# Altium schematic sheet RK3566_USB_GPIO.SchDoc
size A3; SheetNumber: 18; SheetTotal: 20
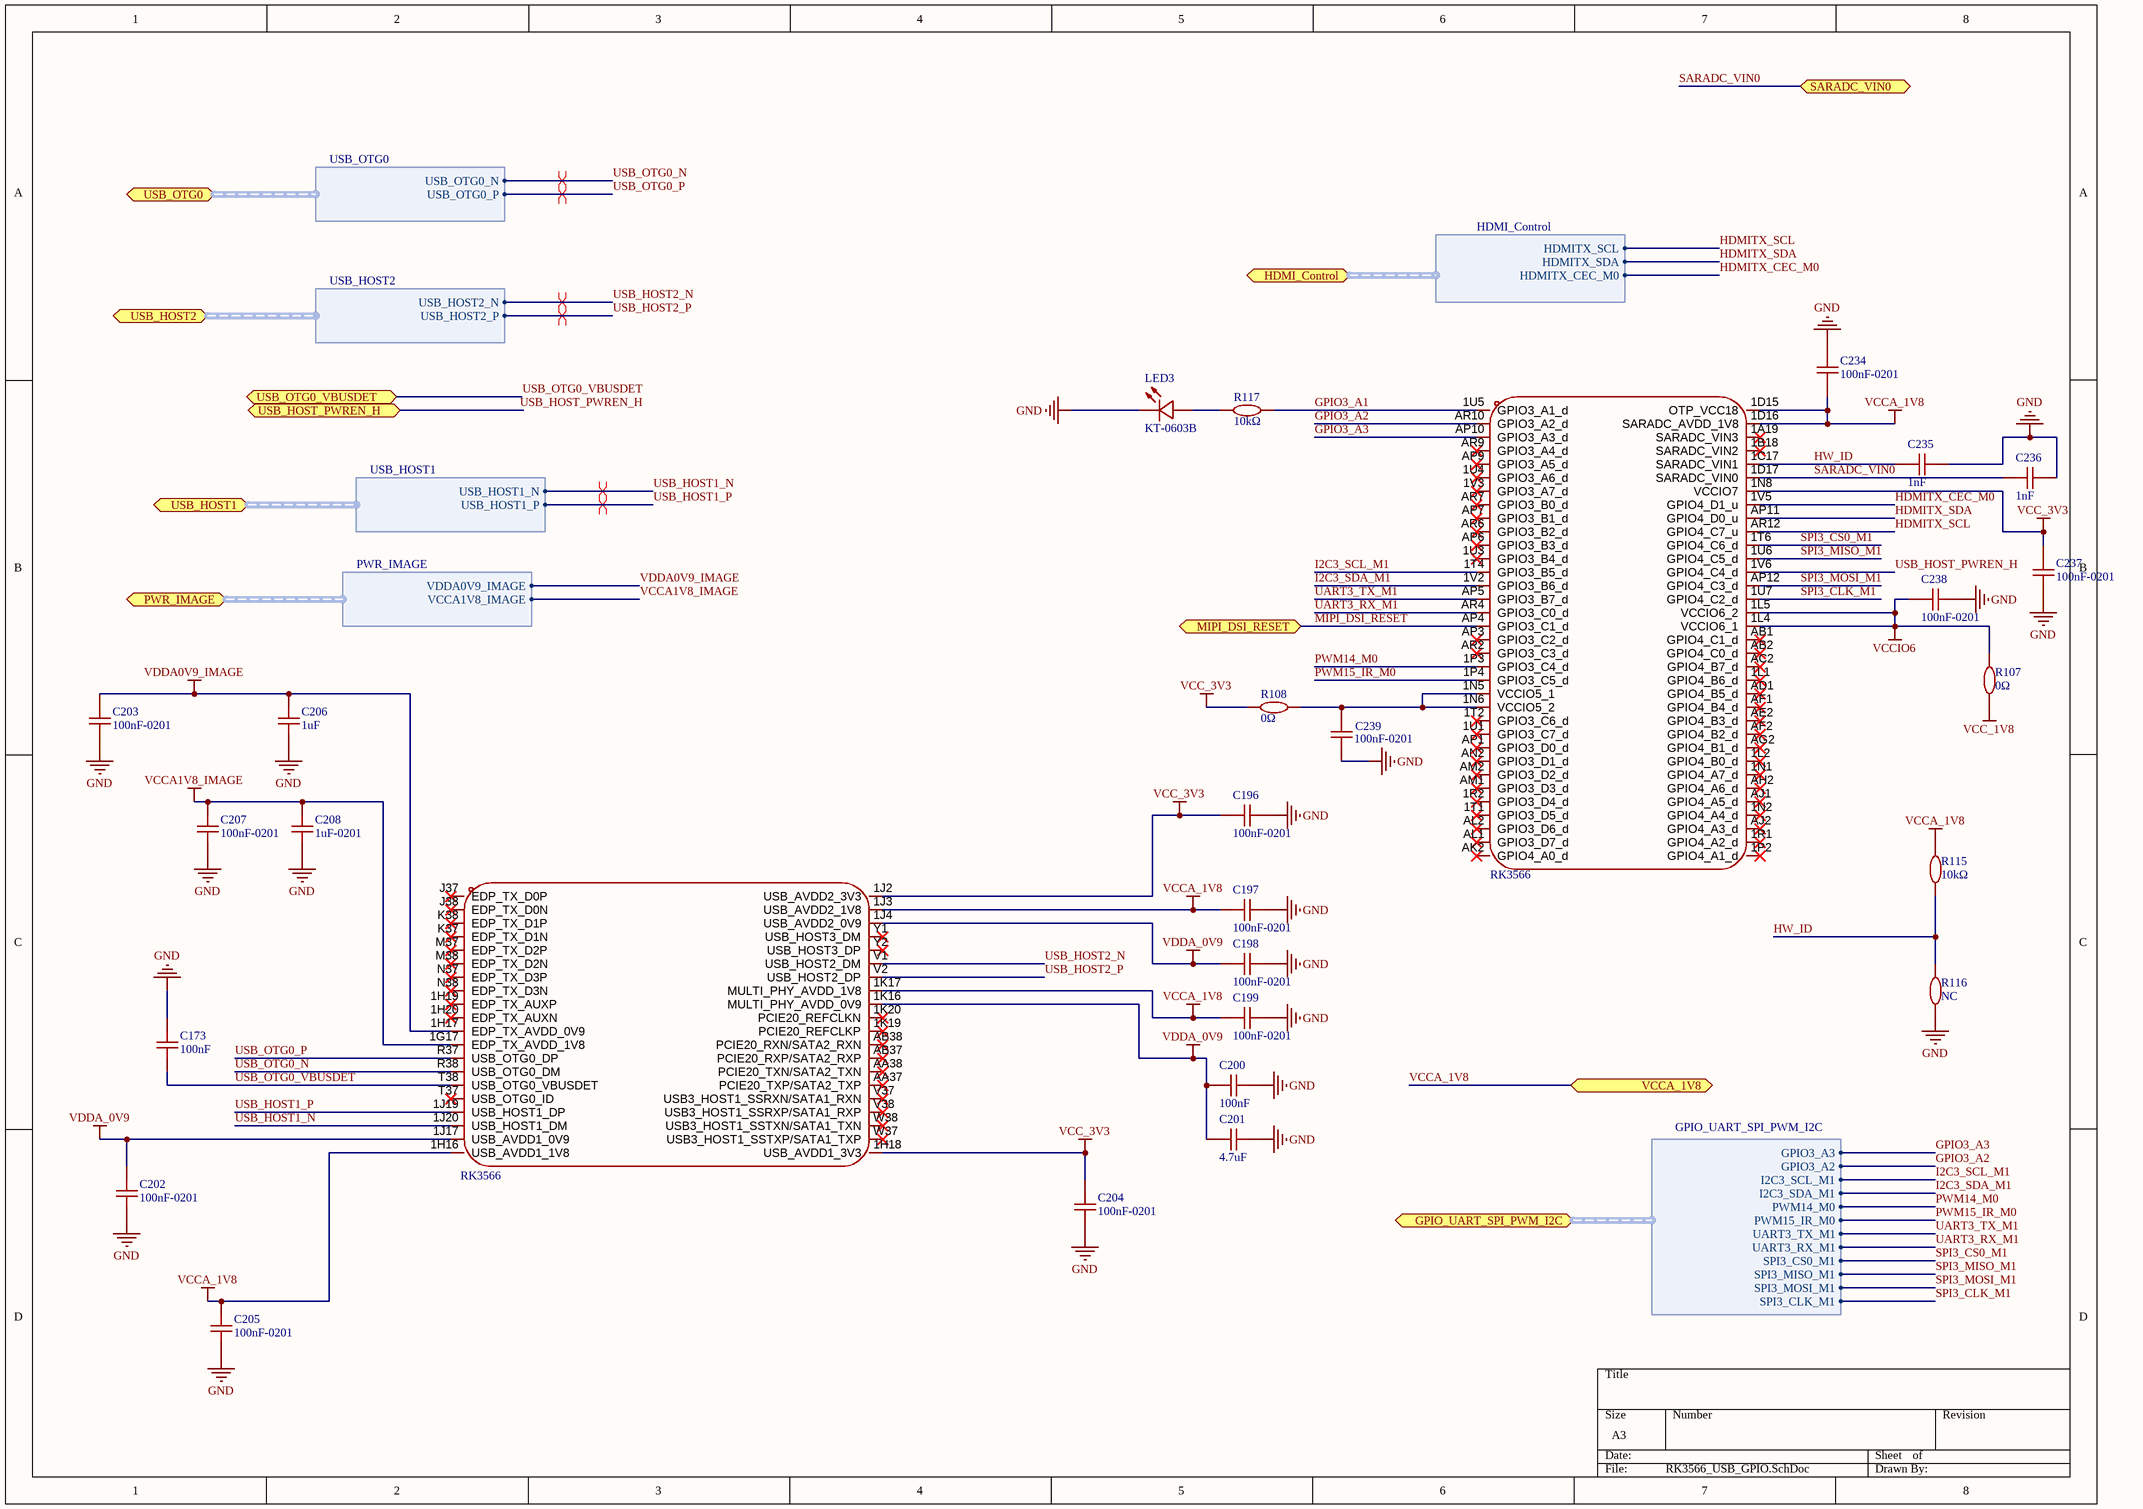
[diagram p0: RK3566_USB_GPIO.SchDoc]

## Parts
C173  100nF  [C0402]
C196  100nF-0201  [C0201]
C197  100nF-0201  [C0201]
C198  100nF-0201  [C0201]
C199  100nF-0201  [C0201]
C200  100nF  [C0402]
C201  4.7uF  [C0402]
C202  100nF-0201  [C0201]
C203  100nF-0201  [C0201]
C204  100nF-0201  [C0201]
C205  100nF-0201  [C0201]
C206  1uF  [C0402]
C207  100nF-0201  [C0201]
C208  1uF-0201  [C0201]
C234  100nF-0201  [C0201]
C235  1nF  [C0402]
C236  1nF  [C0402]
C237  100nF-0201  [C0201]
C238  100nF-0201  [C0201]
C239  100nF-0201  [C0201]
LED3  KT-0603B  [LED0603-BL]
R107  0Ω  [R0402]
R108  0Ω  [R0402]
R115  10kΩ  [R0402]
R116  NC  [R0402]
R117  10kΩ  [R0402]
U2  RK3566  [BGA-565_L15.5-W14.4-P0.40_RK3566_1]  (parts F,H of 8)

## Ports
GPIO_UART_SPI_PWM_I2C (bidir, harness GPIO_UART_SPI_PWM_I2C, see RK3566[1C], DEBUG_AND_GPIO[6A], RK3566[3C]), HDMI_Control (bidir, harness HDMI_Control, see RK3566[2C], HDMI[2D], RK3566[3C]), MIPI_DSI_RESET (bidir, see RK3566[2C], MIPI_DSI_TP[5C], RK3566[3C]), PWR_IMAGE (bidir, harness PWR_IMAGE, see RK3566[2C], POWER[1C], POWER_PMIC[3B], RK3566[3C], RK3566_MIPI_HDMI[5D]), SARADC_VIN0 (bidir, see RK3566[2C], DEBUG_AND_GPIO[6C], RK3566[3C]), USB_HOST1 (bidir, harness USB_HOST1, see RK3566[2C], RK3566[3C], USB_OTG_AND_HOST[6A]), USB_HOST2 (bidir, harness USB_HOST2, see RK3566[2C], RK3566[3C], USB_OTG_AND_HOST[6@]), USB_HOST_PWREN_H (bidir, see RK3566[2C], RK3566[3C], USB_OTG_AND_HOST[7@]), USB_OTG0 (bidir, harness USB_OTG0, see RK3566[2C], RK3566[3C], USB_OTG_AND_HOST[6@]), USB_OTG0_VBUSDET (bidir, see RK3566[2C], RK3566[3C], USB_OTG_AND_HOST[7@]), VCCA_1V8 (bidir, see RK3566[1C], DEBUG_AND_GPIO[6C], POWER[1C], POWER_PMIC[7A], RK3566[3C])

## Harnesses
HDMI_Control: HDMITX_SCL, HDMITX_SDA, HDMITX_CEC_M0
USB_OTG0: USB_OTG0_N, USB_OTG0_P
USB_HOST2: USB_HOST2_N, USB_HOST2_P
USB_HOST1: USB_HOST1_N, USB_HOST1_P
PWR_IMAGE: VDDA0V9_IMAGE, VCCA1V8_IMAGE
GPIO_UART_SPI_PWM_I2C: I2C3_SDA_M1, PWM14_M0, PWM15_IR_M0, I2C3_SCL_M1, GPIO3_A2, UART3_TX_M1, SPI3_CS0_M1, UART3_RX_M1, SPI3_MISO_M1, SPI3_MOSI_M1, SPI3_CLK_M1, GPIO3_A3

## Nets
GND: C173.2 C196.2 C197.2 C198.2 C199.2 C200.2 C201.2 C202.1 C203.1 C204.1 C205.1 C206.1 C207.1 C208.1 C234.1 C235.2 C236.2 C237.2 C238.2 C239.1 LED3.1(K) R116.1
VCC_1V8: R107.1
VCC_3V3: C196.1 C204.2 C237.1 R108.1 U2.1H18(USB_AVDD1_3V3) U2.1J2(USB_AVDD2_3V3) U2.1N8(VCCIO7)
VCCA1V8_IMAGE: C207.2 C208.2 U2.1G17(EDP_TX_AVDD_1V8) ; port PWR_IMAGE.VCCA1V8_IMAGE
VCCA_1V8: C197.1 C199.1 C205.2 C234.2 R115.2 U2.1D15(OTP_VCC18) U2.1D16(SARADC_AVDD_1V8) U2.1H16(USB_AVDD1_1V8) U2.1J3(USB_AVDD2_1V8) U2.1K17(MULTI_PHY_AVDD_1V8) ; port VCCA_1V8
VCCIO6: C238.1 R107.2 U2.1L4(VCCIO6_1) U2.1L5(VCCIO6_2)
VDDA0V9_IMAGE: C203.2 C206.2 U2.1H17(EDP_TX_AVDD_0V9) ; port PWR_IMAGE.VDDA0V9_IMAGE
VDDA_0V9: C198.1 C200.1 C201.1 C202.2 U2.1J4(USB_AVDD2_0V9) U2.1J17(USB_AVDD1_0V9) U2.1K16(MULTI_PHY_AVDD_0V9)
GPIO3_A1: R117.1 U2.1U5(GPIO3_A1_d)
GPIO3_A2: U2.AR10(GPIO3_A2_d) ; port GPIO_UART_SPI_PWM_I2C.GPIO3_A2
GPIO3_A3: U2.AP10(GPIO3_A3_d) ; port GPIO_UART_SPI_PWM_I2C.GPIO3_A3
HDMITX_CEC_M0: U2.1V5(GPIO4_D1_u) ; port HDMI_Control.HDMITX_CEC_M0
HDMITX_SCL: U2.AR12(GPIO4_C7_u) ; port HDMI_Control.HDMITX_SCL
HDMITX_SDA: U2.AP11(GPIO4_D0_u) ; port HDMI_Control.HDMITX_SDA
HW_ID: C235.1 R115.1 R116.2 U2.1C17(SARADC_VIN1)
I2C3_SCL_M1: U2.1T4(GPIO3_B5_d) ; port GPIO_UART_SPI_PWM_I2C.I2C3_SCL_M1
I2C3_SDA_M1: U2.1V2(GPIO3_B6_d) ; port GPIO_UART_SPI_PWM_I2C.I2C3_SDA_M1
MIPI_DSI_RESET: U2.AP4(GPIO3_C1_d) ; port MIPI_DSI_RESET
PWM14_M0: U2.1P3(GPIO3_C4_d) ; port GPIO_UART_SPI_PWM_I2C.PWM14_M0
PWM15_IR_M0: U2.1P4(GPIO3_C5_d) ; port GPIO_UART_SPI_PWM_I2C.PWM15_IR_M0
SARADC_VIN0: C236.1 U2.1D17(SARADC_VIN0) ; port SARADC_VIN0
SPI3_CLK_M1: U2.1U7(GPIO4_C2_d) ; port GPIO_UART_SPI_PWM_I2C.SPI3_CLK_M1
SPI3_CS0_M1: U2.1T6(GPIO4_C6_d) ; port GPIO_UART_SPI_PWM_I2C.SPI3_CS0_M1
SPI3_MISO_M1: U2.1U6(GPIO4_C5_d) ; port GPIO_UART_SPI_PWM_I2C.SPI3_MISO_M1
SPI3_MOSI_M1: U2.AP12(GPIO4_C3_d) ; port GPIO_UART_SPI_PWM_I2C.SPI3_MOSI_M1
UART3_RX_M1: U2.AR4(GPIO3_C0_d) ; port GPIO_UART_SPI_PWM_I2C.UART3_RX_M1
UART3_TX_M1: U2.AP5(GPIO3_B7_d) ; port GPIO_UART_SPI_PWM_I2C.UART3_TX_M1
USB_HOST1_N: U2.1J20(USB_HOST1_DM) ; port USB_HOST1.USB_HOST1_N
USB_HOST1_P: U2.1J19(USB_HOST1_DP) ; port USB_HOST1.USB_HOST1_P
USB_HOST2_N: U2.V1(USB_HOST2_DM) ; port USB_HOST2.USB_HOST2_N
USB_HOST2_P: U2.V2(USB_HOST2_DP) ; port USB_HOST2.USB_HOST2_P
USB_HOST_PWREN_H: U2.1V6(GPIO4_C4_d) ; port USB_HOST_PWREN_H
USB_OTG0_N: U2.R38(USB_OTG0_DM) ; port USB_OTG0.USB_OTG0_N
USB_OTG0_P: U2.R37(USB_OTG0_DP) ; port USB_OTG0.USB_OTG0_P
USB_OTG0_VBUSDET: C173.1 U2.T38(USB_OTG0_VBUSDET) ; port USB_OTG0_VBUSDET
NetC239_2: C239.2 R108.2 U2.1N5(VCCIO5_1) U2.1N6(VCCIO5_2)
NetLED3_2: LED3.2(A) R117.2

Not connected (* = marked no-connect by the designer): U2 1A19(SARADC_VIN3)* 1B18(SARADC_VIN2)* 1H19(EDP_TX_AUXP)* 1H20(EDP_TX_AUXN)* 1K19(PCIE20_REFCLKP)* 1K20(PCIE20_REFCLKN)* 1L1(GPIO4_B6_d)* 1L2(GPIO4_B0_d)* 1N1(GPIO4_A7_d)* 1N2(GPIO4_A4_d)* 1P2(GPIO4_A1_d)* 1R1(GPIO4_A2_d)* 1R2(GPIO3_D4_d)* 1T1(GPIO3_D5_d)* 1T2(GPIO3_C6_d)* 1U1(GPIO3_C7_d)* 1U3(GPIO3_B4_d)* 1U4(GPIO3_A6_d)* 1V3(GPIO3_A7_d)* AA37(PCIE20_TXP/SATA2_TXP)* AA38(PCIE20_TXN/SATA2_TXN)* AB1(GPIO4_C1_d)* AB2(GPIO4_C0_d)* AB37(PCIE20_RXP/SATA2_RXP)* AB38(PCIE20_RXN/SATA2_RXN)* AC2(GPIO4_B7_d)* AD1(GPIO4_B5_d)* AE2(GPIO4_B3_d)* AF1(GPIO4_B4_d)* AF2(GPIO4_B2_d)* AG2(GPIO4_B1_d)* AH2(GPIO4_A6_d)* AJ1(GPIO4_A5_d)* AJ2(GPIO4_A3_d)* AK2(GPIO4_A0_d)* AL1(GPIO3_D7_d)* AL2(GPIO3_D6_d)* AM1(GPIO3_D3_d)* AM2(GPIO3_D2_d)* AN2(GPIO3_D1_d)* AP1(GPIO3_D0_d)* AP3(GPIO3_C2_d)* AP6(GPIO3_B3_d)* AP7(GPIO3_B1_d)* AP9(GPIO3_A5_d)* AR2(GPIO3_C3_d)* AR6(GPIO3_B2_d)* AR7(GPIO3_B0_d)* AR9(GPIO3_A4_d)* J37(EDP_TX_D0P)* J38(EDP_TX_D0N)* K37(EDP_TX_D1N)* K38(EDP_TX_D1P)* M37(EDP_TX_D2P)* M38(EDP_TX_D2N)* N37(EDP_TX_D3P)* N38(EDP_TX_D3N)* T37(USB_OTG0_ID)* V37(USB3_HOST1_SSRXN/SATA1_RXN)* V38(USB3_HOST1_SSRXP/SATA1_RXP)* W37(USB3_HOST1_SSTXP/SATA1_TXP)* W38(USB3_HOST1_SSTXN/SATA1_TXN)* Y1(USB_HOST3_DM)* Y2(USB_HOST3_DP)*

## Layout directives
differential pair: USB_HOST1_N, USB_HOST1_P, USB_HOST2_N, USB_HOST2_P, USB_OTG0_N, USB_OTG0_P

## Library data of the parts
C173 C200 = 100nF: 50V 100nF X7R ±10% 0402 Ceramic Capacitors ROHS
C196-C199 C202-C205 C207 C234 C237-C239 = 100nF-0201: CL03A104KO3NNNC
C201 = 4.7uF: 10V 4.7uF X5R ±20% 0402 Ceramic Capacitors ROHS
C206 = 1uF: 50V 1uF X5R ±10% 0402 Ceramic Capacitors ROHS
C208 = 1uF-0201: CL03A104KO3NNNC
C235 C236 = 1nF: 50V 1nF X7R ±10% 0402 Ceramic Capacitors ROHS
LED3 = KT-0603B: 30mA 2.6V~3.2V Blue 0603 LED Indication - Discrete ROHS
R107 R108 = 0Ω: 0Ω 62.5mW 50V Thick Film Resistor ±1% 0402 Chip Resistor - Surface Mount ROHS
R115-R117 = 10kΩ: 62.5mW 10kΩ 50V ±100ppm/℃ Thick Film Resistor ±1% 0402 Chip Resistor - Surface Mount ROHS
U2 = RK3566: BGA-565(15.5x14.4); Symbol: RK3566